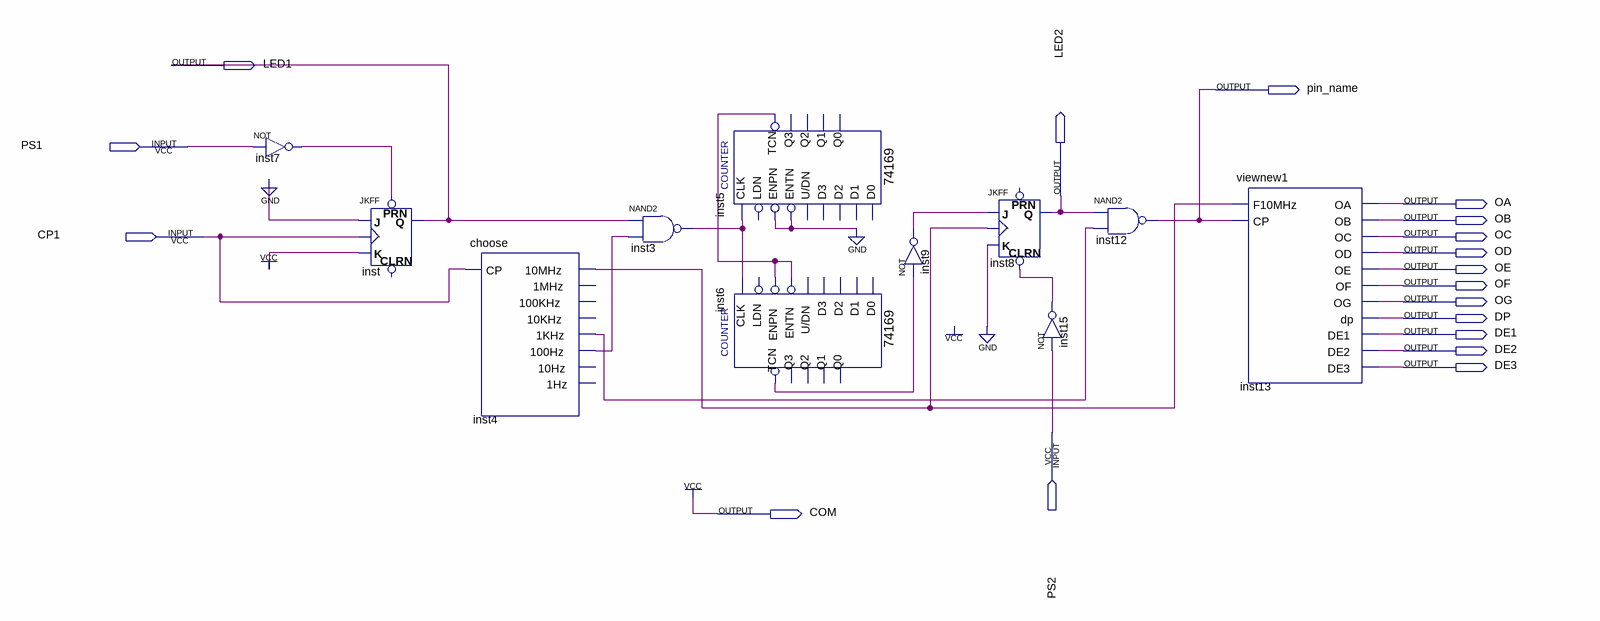
[diagram p0: schematic sheet]
// Quartus schematic influenced.bdf as structural Verilog: 11 symbols, 18 pins
module influenced (
  input  PS1,
  input  CP1,
  input  PS2,
  output LED1,
  output pin_name,
  output LED2,
  output OA,
  output OB,
  output OC,
  output OD,
  output OE,
  output OF,
  output OG,
  output DP,
  output DE1,
  output DE2,
  output DE3,
  output COM
);

  wire inst3_out, inst4_1khz, inst4_10mhz, inst4_100hz, inst5_tcn, inst6_tcn, inst7_out, inst9_out,
       inst15_out;

  not inst7 (inst7_out, PS1);
  JKFF inst (.PRN(inst7_out), .K(1'b1), .J(1'b0), .CLK(CP1), .Q(LED1));  // open: CLRN
  choose inst4 (
    .CP(CP1), .\10MHz (inst4_10mhz), .\1KHz (inst4_1khz), .\100Hz (inst4_100hz));  // open: 1MHz, 100KHz, 10KHz, 10Hz, 1Hz
  nand inst3 (inst3_out, LED1, inst4_100hz);
  \74169  inst5 (
    .ENTN(1'b0), .CLK(inst3_out), .ENPN(1'b0), .TCN(inst5_tcn));  // open: D1, D2, D0, U/DN, D3, LDN, Q2, Q1, Q0, Q3
  \74169  inst6 (
    .ENTN(inst5_tcn), .CLK(inst3_out), .ENPN(inst5_tcn), .TCN(inst6_tcn));  // open: D1, D2, D0, U/DN, D3, LDN, Q2, Q1, Q0, Q3
  not inst9 (inst9_out, inst6_tcn);
  JKFF inst8 (.CLRN(inst15_out), .K(1'b0), .J(inst9_out), .CLK(inst4_10mhz), .Q(LED2));  // open: PRN
  not inst15 (inst15_out, PS2);
  nand inst12 (pin_name, LED2, inst4_1khz);
  viewnew1 inst13 (
    .F10MHz(inst4_10mhz), .CP(pin_name), .OA(OA), .OB(OB), .OC(OC), .OD(OD), .OE(OE), .OF(OF), .OG(OG),
    .dp(DP), .DE1(DE1), .DE2(DE2), .DE3(DE3));

  assign COM = 1'b1;
endmodule
